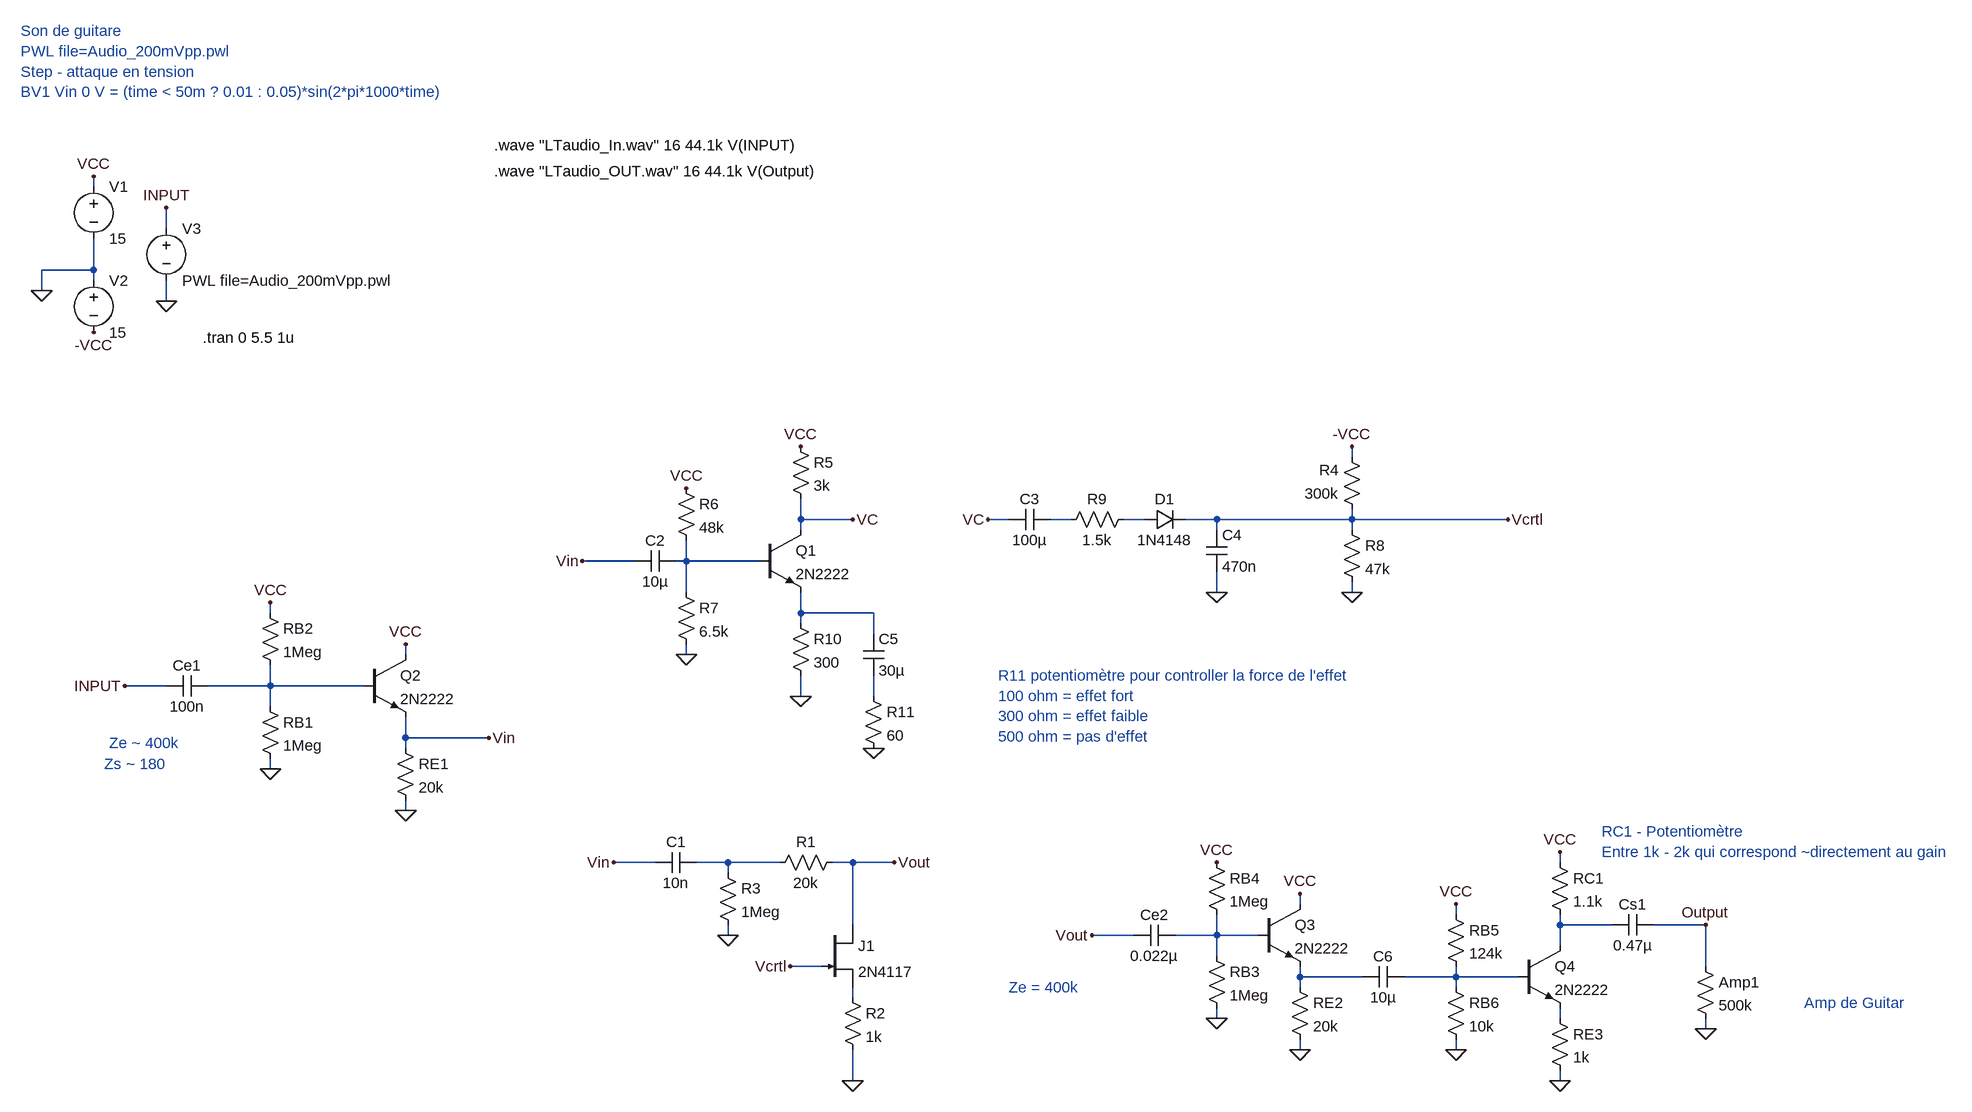
[diagram p0: schematic AUDIO_TEST_Circuit.asc]
AUDIO_TEST_Circuit.asc, the LTspice schematic file:
Version 4
SHEET 1 2028 1056
WIRE -1184 -480 -1184 -496
WIRE -1072 -416 -1072 -448
WIRE -1184 -352 -1184 -400
WIRE -1184 -352 -1264 -352
WIRE -1184 -336 -1184 -352
WIRE -1264 -320 -1264 -352
WIRE -1072 -304 -1072 -336
WIRE 752 -64 752 -80
WIRE -96 32 -96 0
WIRE -16 32 -96 32
WIRE 224 32 192 32
WIRE 320 32 288 32
WIRE 432 32 400 32
WIRE 544 32 496 32
WIRE 752 32 752 16
WIRE 752 32 544 32
WIRE 992 32 752 32
WIRE -96 48 -96 32
WIRE 544 48 544 32
WIRE 752 48 752 32
WIRE -352 96 -432 96
WIRE -272 96 -272 64
WIRE -272 96 -288 96
WIRE -160 96 -272 96
WIRE -272 144 -272 96
WIRE 544 144 544 112
WIRE 752 144 752 128
WIRE -912 176 -912 160
WIRE -96 176 -96 144
WIRE 16 176 -96 176
WIRE -96 192 -96 176
WIRE 16 208 16 176
WIRE -704 240 -704 224
WIRE -272 240 -272 224
WIRE -1072 288 -1136 288
WIRE -912 288 -912 256
WIRE -912 288 -1008 288
WIRE -768 288 -912 288
WIRE -96 304 -96 272
WIRE 16 304 16 272
WIRE -912 320 -912 288
WIRE -704 368 -704 336
WIRE -576 368 -704 368
WIRE -704 384 -704 368
WIRE -912 416 -912 400
WIRE -704 480 -704 464
WIRE -320 560 -384 560
WIRE -208 560 -256 560
WIRE -128 560 -208 560
WIRE -16 560 -48 560
WIRE 48 560 -16 560
WIRE 1072 560 1072 544
WIRE -208 576 -208 560
WIRE 672 624 672 608
WIRE 912 640 912 624
WIRE -16 656 -16 560
WIRE 1072 656 1072 640
WIRE 1152 656 1072 656
WIRE 1296 656 1216 656
WIRE -208 672 -208 656
WIRE 416 672 352 672
WIRE 544 672 544 640
WIRE 544 672 480 672
WIRE 608 672 544 672
WIRE 1072 688 1072 656
WIRE 544 704 544 672
WIRE -64 720 -112 720
WIRE 1296 720 1296 656
WIRE 672 736 672 720
WIRE 768 736 672 736
WIRE 912 736 912 720
WIRE 912 736 832 736
WIRE 1008 736 912 736
WIRE 672 752 672 736
WIRE 912 752 912 736
WIRE -16 768 -16 752
WIRE 544 800 544 784
WIRE 1072 800 1072 784
WIRE 1296 816 1296 800
WIRE 672 848 672 832
WIRE 912 848 912 832
WIRE -16 896 -16 848
WIRE 1072 896 1072 880
FLAG -1072 -304 0
FLAG -1072 -448 INPUT
FLAG 48 560 Vout
FLAG -16 896 0
FLAG -208 672 0
FLAG -96 304 0
FLAG -272 240 0
FLAG -272 -16 VCC
FLAG -96 -80 VCC
FLAG -1184 -496 VCC
FLAG 544 144 0
FLAG 992 32 Vcrtl
FLAG -1264 -320 0
FLAG -1184 -256 -VCC
FLAG 752 144 0
FLAG 752 -80 -VCC
FLAG -112 720 Vcrtl
FLAG -912 416 0
FLAG -912 160 VCC
FLAG -704 224 VCC
FLAG -1136 288 INPUT
FLAG -432 96 Vin
FLAG -384 560 Vin
FLAG 544 800 0
FLAG 544 560 VCC
FLAG 672 608 VCC
FLAG 1296 656 Output
FLAG 352 672 Vout
FLAG 1296 816 0
FLAG 16 384 0
FLAG -576 368 Vin
FLAG -704 480 0
FLAG 672 848 0
FLAG 912 624 VCC
FLAG 1072 544 VCC
FLAG 912 848 0
FLAG 1072 896 0
FLAG 192 32 VC
FLAG -16 32 VC
SYMBOL njf -64 656 R0
SYMATTR InstName J1
SYMATTR Value 2N4117
SYMBOL res -32 544 R90
WINDOW 0 0 56 VBottom 2
WINDOW 3 32 56 VTop 2
SYMATTR InstName R1
SYMATTR Value 20k
SYMBOL cap -256 544 R90
WINDOW 0 0 32 VBottom 2
WINDOW 3 32 32 VTop 2
SYMATTR InstName C1
SYMATTR Value 10n
SYMBOL res -32 752 R0
SYMATTR InstName R2
SYMATTR Value 1k
SYMBOL res -224 560 R0
SYMATTR InstName R3
SYMATTR Value 1Meg
SYMBOL res 768 32 R180
WINDOW 0 36 76 Left 2
WINDOW 3 36 40 Left 2
SYMATTR InstName R4
SYMATTR Value 300k
SYMBOL npn -160 48 R0
SYMATTR InstName Q1
SYMATTR Value 2N2222
SYMBOL res -112 -96 R0
SYMATTR InstName R5
SYMATTR Value 3k
SYMBOL res -288 -32 R0
SYMATTR InstName R6
SYMATTR Value 48k
SYMBOL res -288 128 R0
SYMATTR InstName R7
SYMATTR Value 6.5k
SYMBOL voltage -1184 -496 R0
WINDOW 123 0 0 Left 0
WINDOW 39 0 0 Left 0
SYMATTR InstName V1
SYMATTR Value 15
SYMBOL cap -288 80 R90
WINDOW 0 0 32 VBottom 2
WINDOW 3 32 32 VTop 2
SYMATTR InstName C2
SYMATTR Value 10µ
SYMBOL cap 288 16 R90
WINDOW 0 0 32 VBottom 2
WINDOW 3 32 32 VTop 2
SYMATTR InstName C3
SYMATTR Value 100µ
SYMBOL diode 432 48 R270
WINDOW 0 32 32 VTop 2
WINDOW 3 0 32 VBottom 2
SYMATTR InstName D1
SYMATTR Value 1N4148
SYMBOL cap 528 48 R0
SYMATTR InstName C4
SYMATTR Value 470n
SYMBOL voltage -1184 -352 R0
WINDOW 123 0 0 Left 0
WINDOW 39 0 0 Left 0
SYMATTR InstName V2
SYMATTR Value 15
SYMBOL cap 0 208 R0
SYMATTR InstName C5
SYMATTR Value 30µ
SYMBOL res 736 32 R0
SYMATTR InstName R8
SYMATTR Value 47k
SYMBOL res 416 16 R90
WINDOW 0 0 56 VBottom 2
WINDOW 3 32 56 VTop 2
SYMATTR InstName R9
SYMATTR Value 1.5k
SYMBOL res -112 176 R0
SYMATTR InstName R10
SYMATTR Value 300
SYMBOL res -928 304 R0
SYMATTR InstName RB1
SYMATTR Value 1Meg
SYMBOL res -928 160 R0
SYMATTR InstName RB2
SYMATTR Value 1Meg
SYMBOL res -720 368 R0
SYMATTR InstName RE1
SYMATTR Value 20k
SYMBOL npn -768 240 R0
SYMATTR InstName Q2
SYMATTR Value 2N2222
SYMBOL cap -1008 272 R90
WINDOW 0 0 32 VBottom 2
WINDOW 3 32 32 VTop 2
SYMATTR InstName Ce1
SYMATTR Value 100n
SYMBOL res 528 688 R0
SYMATTR InstName RB3
SYMATTR Value 1Meg
SYMBOL res 528 544 R0
SYMATTR InstName RB4
SYMATTR Value 1Meg
SYMBOL res 656 736 R0
SYMATTR InstName RE2
SYMATTR Value 20k
SYMBOL npn 608 624 R0
SYMATTR InstName Q3
SYMATTR Value 2N2222
SYMBOL cap 480 656 R90
WINDOW 0 0 32 VBottom 2
WINDOW 3 32 32 VTop 2
SYMATTR InstName Ce2
SYMATTR Value 0.022µ
SYMBOL res 896 624 R0
SYMATTR InstName RB5
SYMATTR Value 124k
SYMBOL res 896 736 R0
SYMATTR InstName RB6
SYMATTR Value 10k
SYMBOL res 1056 784 R0
SYMATTR InstName RE3
SYMATTR Value 1k
SYMBOL res 1056 544 R0
SYMATTR InstName RC1
SYMATTR Value 1.1k
SYMBOL npn 1008 688 R0
SYMATTR InstName Q4
SYMATTR Value 2N2222
SYMBOL cap 1216 640 R90
WINDOW 0 0 32 VBottom 2
WINDOW 3 32 32 VTop 2
SYMATTR InstName Cs1
SYMATTR Value 0.47µ
SYMBOL res 1280 704 R0
SYMATTR InstName Amp1
SYMATTR Value 500k
SYMBOL cap 832 720 R90
WINDOW 0 0 32 VBottom 2
WINDOW 3 32 32 VTop 2
SYMATTR InstName C6
SYMATTR Value 10µ
SYMBOL res 0 288 R0
SYMATTR InstName R11
SYMATTR Value 60
SYMBOL voltage -1072 -432 R0
SYMATTR InstName V3
SYMATTR Value PWL file=Audio_200mVpp.pwl
TEXT -1016 -248 Left 2 !.tran 0 5.5 1u
TEXT -1160 376 Left 2 ;Ze ~ 400k
TEXT -1168 408 Left 2 ;Zs ~ 180
TEXT 1448 776 Left 2 ;Amp de Guitar
TEXT 224 752 Left 2 ;Ze = 400k
TEXT 208 272 Left 2 ;R11 potentiomètre pour controller la force de l'effet\n100 ohm = effet fort\n300 ohm = effet faible\n500 ohm = pas d'effet
TEXT -568 -544 Left 2 !.wave "LTaudio_In.wav" 16 44.1k V(INPUT)
TEXT -568 -504 Left 2 !.wave "LTaudio_OUT.wav" 16 44.1k V(Output)
TEXT 1136 512 Left 2 ;RC1 - Potentiomètre\nEntre 1k - 2k qui correspond ~directement au gain
TEXT -1296 -720 Left 2 ;Son de guitare\nPWL file=Audio_200mVpp.pwl \nStep - attaque en tension\nBV1 Vin 0 V = (time < 50m ? 0.01 : 0.05)*sin(2*pi*1000*time)

The netlist it stands for:
* AUDIO_TEST_Circuit.asc
J1 Vout Vcrtl N012 2N4117
R1 Vout N007 20k
C1 N007 Vin 10n
R2 N012 0 1k
R3 N007 0 1Meg
R4 Vcrtl -VCC 300k
Q1 VC N003 N004 0 2N2222
R5 VCC VC 3k
R6 VCC N003 48k
R7 N003 0 6.5k
V1 VCC 0 15
C2 N003 Vin 10µ
C3 N001 VC 100µ
D1 N002 Vcrtl 1N4148
C4 Vcrtl 0 470n
V2 0 -VCC 15
C5 N004 N006 30µ
R8 Vcrtl 0 47k
R9 N002 N001 1.5k
R10 N004 0 300
RB1 N005 0 1Meg
RB2 VCC N005 1Meg
RE1 Vin 0 20k
Q2 VCC N005 Vin 0 2N2222
Ce1 N005 INPUT 100n
RB3 N009 0 1Meg
RB4 VCC N009 1Meg
RE2 N010 0 20k
Q3 VCC N009 N010 0 2N2222
Ce2 N009 Vout 0.022µ
RB5 VCC N011 124k
RB6 N011 0 10k
RE3 N013 0 1k
RC1 VCC N008 1.1k
Q4 N008 N011 N013 0 2N2222
Cs1 Output N008 0.47µ
R§Amp1 Output 0 500k
C6 N011 N010 10µ
R11 N006 0 60
V3 INPUT 0 PWL file=Audio_200mVpp.pwl
.model D D
.lib standard.dio
.model NPN NPN
.model PNP PNP
.lib standard.bjt
.model NJF NJF
.model PJF PJF
.lib standard.jft
.tran 0 5.5 1u
* Ze ~ 400k
* Zs ~ 180
* Amp de Guitar
* Ze = 400k
* R11 potentiomètre pour controller la force de l'effet
* 100 ohm = effet fort
* 300 ohm = effet faible
* 500 ohm = pas d'effet
.wave "LTaudio_In.wav" 16 44.1k V(INPUT)
.wave "LTaudio_OUT.wav" 16 44.1k V(Output)
* RC1 - Potentiomètre
* Entre 1k - 2k qui correspond ~directement au gain
* Son de guitare
* PWL file=Audio_200mVpp.pwl
* Step - attaque en tension
* BV1 Vin 0 V = (time < 50m ? 0.01 : 0.05)*sin(2*pi*1000*time)
.backanno
.end